# Altium schematic sheet cgd_gio.schdoc
size A3; Organization: Develer s.r.l.; Address1: via Mugellese 1/A; Address2: 50019 Campi Bisenzio; Address3: Firenze; Address4: ITALY; Revision: A; SheetNumber: 1; SheetTotal: 1
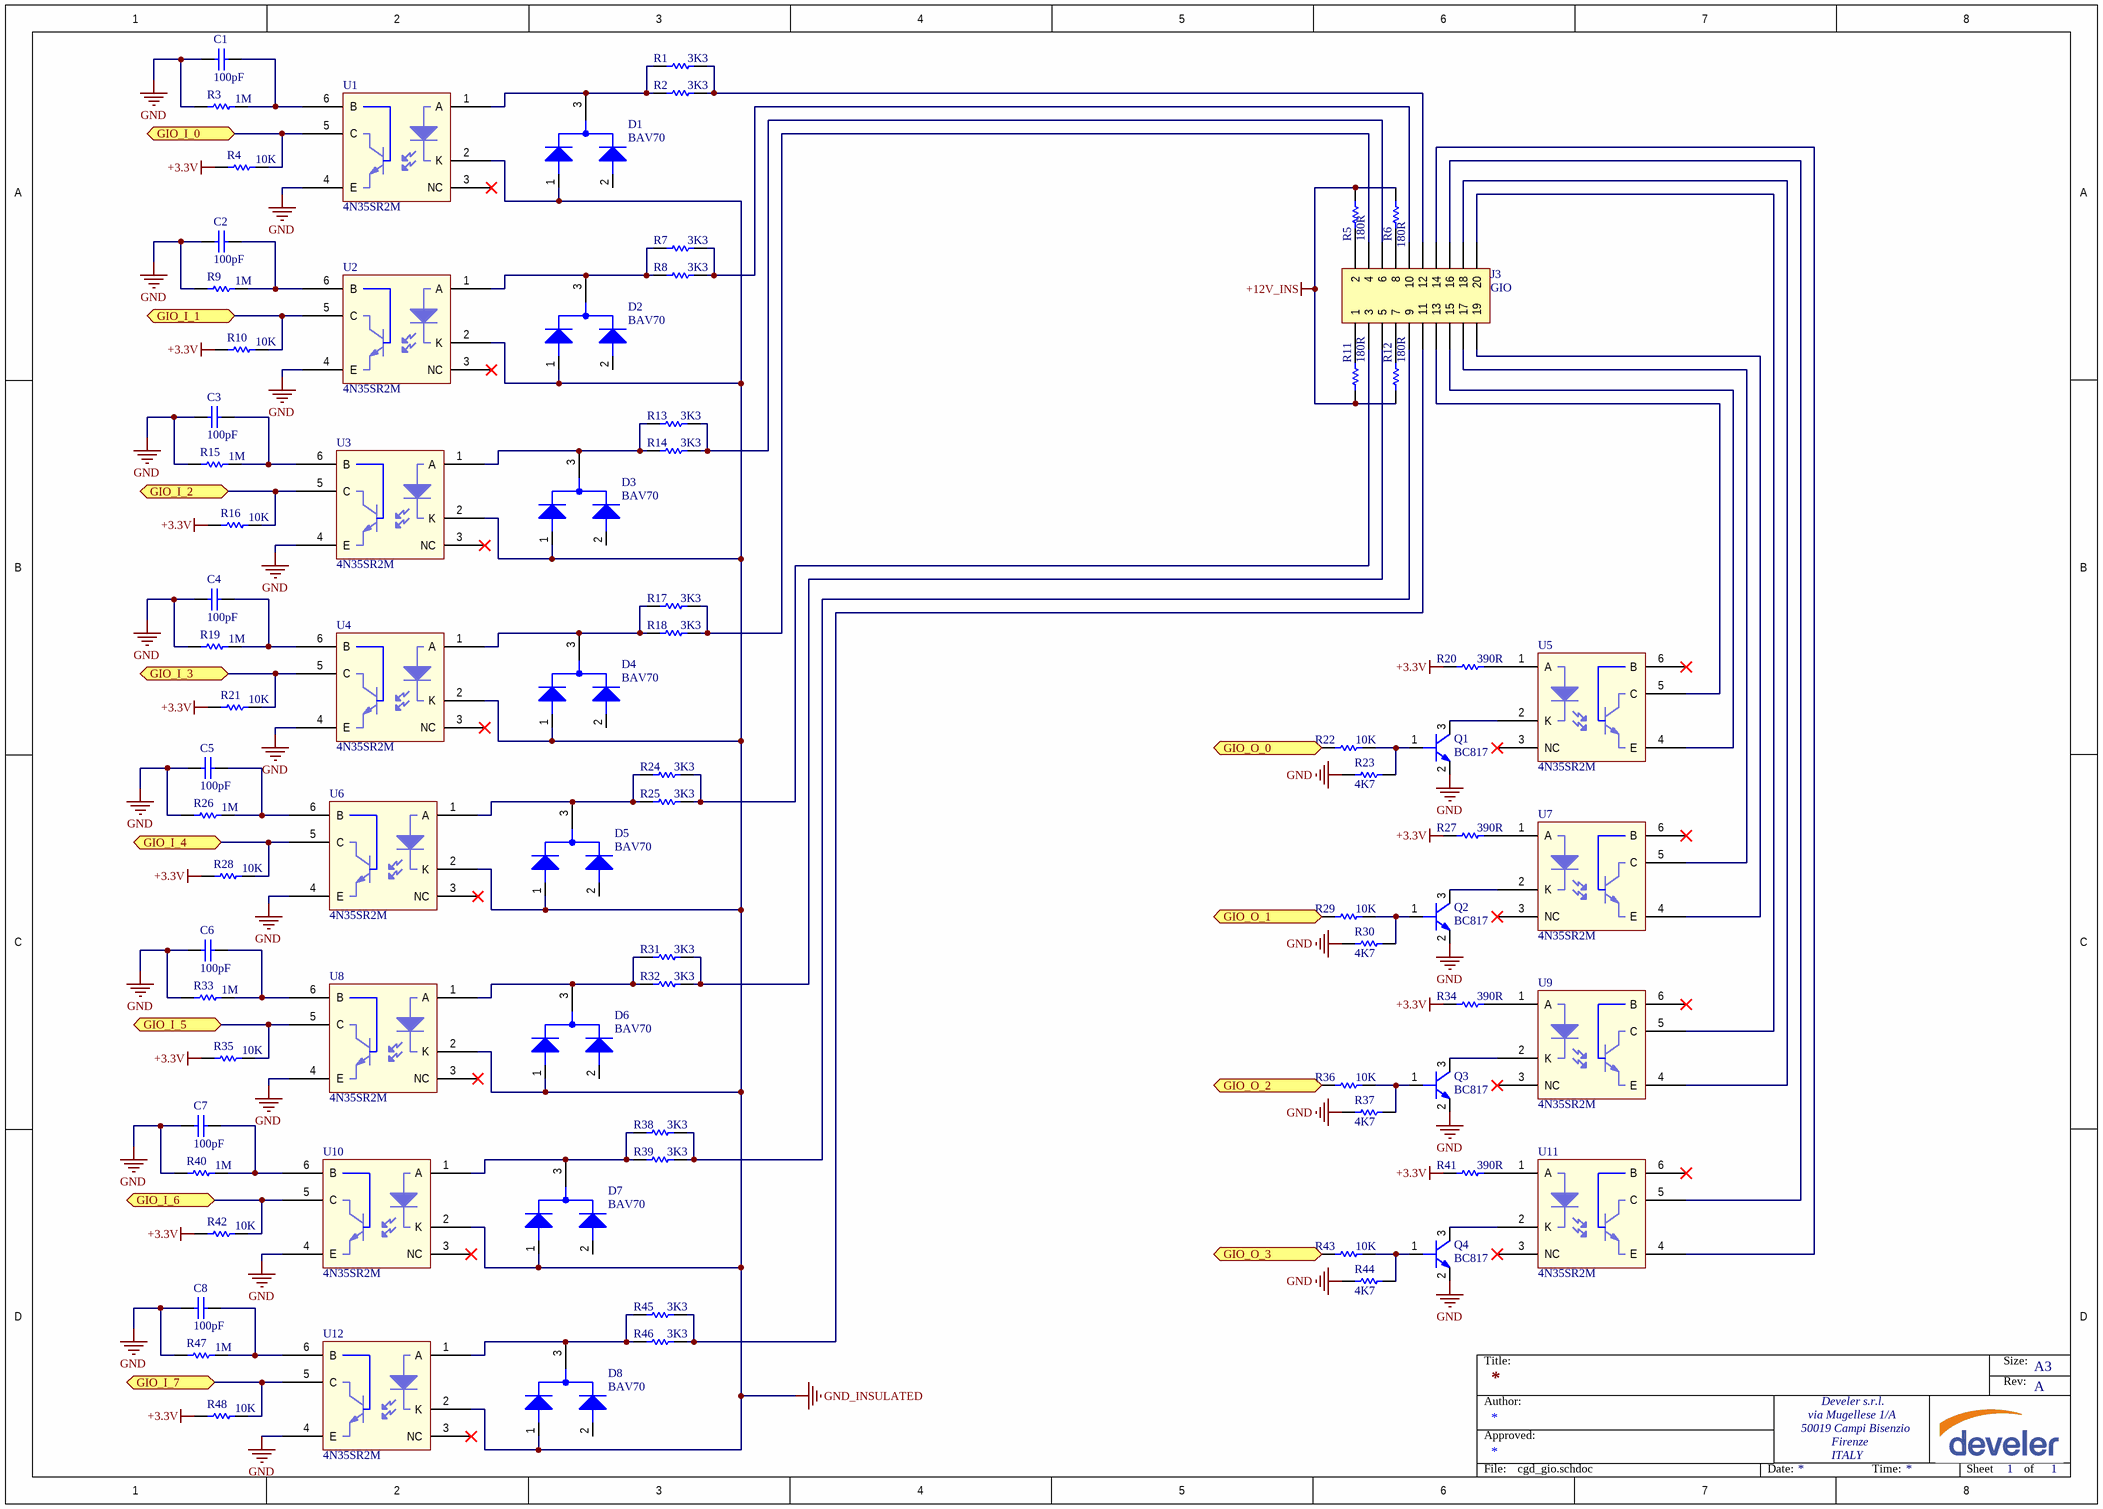
[diagram p0: cgd_gio.schdoc]

## Parts
C1  100pF  [0603_[1608]]
C2  100pF  [0603_[1608]]
C3  100pF  [0603_[1608]]
C4  100pF  [0603_[1608]]
C5  100pF  [0603_[1608]]
C6  100pF  [0603_[1608]]
C7  100pF  [0603_[1608]]
C8  100pF  [0603_[1608]]
D1  BAV70  [SOT-23]
D2  BAV70  [SOT-23]
D3  BAV70  [SOT-23]
D4  BAV70  [SOT-23]
D5  BAV70  [SOT-23]
D6  BAV70  [SOT-23]
D7  BAV70  [SOT-23]
D8  BAV70  [SOT-23]
J3  GIO  [TBLOCK_2X10_3.5MM_HOR_THD_FLANGED]
Q1  BC817  [SOT-23]
Q2  BC817  [SOT-23]
Q3  BC817  [SOT-23]
Q4  BC817  [SOT-23]
R1  3K3  [0603_[1608]]
R2  3K3  [0603_[1608]]
R3  1M  [0603_[1608]]
R4  10K  [0603_[1608]]
R5  180R  [0603_[1608]]
R6  180R  [0603_[1608]]
R7  3K3  [0603_[1608]]
R8  3K3  [0603_[1608]]
R9  1M  [0603_[1608]]
R10  10K  [0603_[1608]]
R11  180R  [0603_[1608]]
R12  180R  [0603_[1608]]
R13  3K3  [0603_[1608]]
R14  3K3  [0603_[1608]]
R15  1M  [0603_[1608]]
R16  10K  [0603_[1608]]
R17  3K3  [0603_[1608]]
R18  3K3  [0603_[1608]]
R19  1M  [0603_[1608]]
R20  390R  [0603_[1608]]
R21  10K  [0603_[1608]]
R22  10K  [0603_[1608]]
R23  4K7  [0603_[1608]]
R24  3K3  [0603_[1608]]
R25  3K3  [0603_[1608]]
R26  1M  [0603_[1608]]
R27  390R  [0603_[1608]]
R28  10K  [0603_[1608]]
R29  10K  [0603_[1608]]
R30  4K7  [0603_[1608]]
R31  3K3  [0603_[1608]]
R32  3K3  [0603_[1608]]
R33  1M  [0603_[1608]]
R34  390R  [0603_[1608]]
R35  10K  [0603_[1608]]
R36  10K  [0603_[1608]]
R37  4K7  [0603_[1608]]
R38  3K3  [0603_[1608]]
R39  3K3  [0603_[1608]]
R40  1M  [0603_[1608]]
R41  390R  [0603_[1608]]
R42  10K  [0603_[1608]]
R43  10K  [0603_[1608]]
R44  4K7  [0603_[1608]]
R45  3K3  [0603_[1608]]
R46  3K3  [0603_[1608]]
R47  1M  [0603_[1608]]
R48  10K  [0603_[1608]]
U1  4N35SR2M  [SOIC6_OPTO]
U2  4N35SR2M  [SOIC6_OPTO]
U3  4N35SR2M  [SOIC6_OPTO]
U4  4N35SR2M  [SOIC6_OPTO]
U5  4N35SR2M  [SOIC6_OPTO]
U6  4N35SR2M  [SOIC6_OPTO]
U7  4N35SR2M  [SOIC6_OPTO]
U8  4N35SR2M  [SOIC6_OPTO]
U9  4N35SR2M  [SOIC6_OPTO]
U10  4N35SR2M  [SOIC6_OPTO]
U11  4N35SR2M  [SOIC6_OPTO]
U12  4N35SR2M  [SOIC6_OPTO]

## Ports
GIO_I_0, GIO_I_1, GIO_I_2, GIO_I_3, GIO_I_4, GIO_I_5, GIO_I_6, GIO_I_7, GIO_O_0, GIO_O_1, GIO_O_2, GIO_O_3

## Nets
+3.3V: R4.2 R10.2 R16.2 R20.2 R21.2 R27.2 R28.2 R34.2 R35.2 R41.2 R42.2 R48.2
+12V_INS: R5.1 R6.1 R11.2 R12.2
GND: C1.2 C2.2 C3.2 C4.2 C5.2 C6.2 C7.2 C8.2 Q1.2(E) Q2.2(E) Q3.2(E) Q4.2(E) R3.2 R9.2 R15.2 R19.2 R23.1 R26.2 R30.1 R33.2 R37.1 R40.2 R44.1 R47.2 U1.4(E) U2.4(E) U3.4(E) U4.4(E) U6.4(E) U8.4(E) U10.4(E) U12.4(E)
GND_INSULATED: D1.1 D2.1 D3.1 D4.1 D5.1 D6.1 D7.1 D8.1 U1.2(K) U2.2(K) U3.2(K) U4.2(K) U6.2(K) U8.2(K) U10.2(K) U12.2(K)
GIO_I_0: R4.1 U1.5(C) ; port GIO_I_0
GIO_I_1: R10.1 U2.5(C) ; port GIO_I_1
GIO_I_2: R16.1 U3.5(C) ; port GIO_I_2
GIO_I_3: R21.1 U4.5(C) ; port GIO_I_3
GIO_I_4: R28.1 U6.5(C) ; port GIO_I_4
GIO_I_5: R35.1 U8.5(C) ; port GIO_I_5
GIO_I_6: R42.1 U10.5(C) ; port GIO_I_6
GIO_I_7: R48.1 U12.5(C) ; port GIO_I_7
GIO_O_0: R22.2 ; port GIO_O_0
GIO_O_1: R29.2 ; port GIO_O_1
GIO_O_2: R36.2 ; port GIO_O_2
GIO_O_3: R43.2 ; port GIO_O_3
NetC1_1: C1.1 R3.1 U1.6(B)
NetC2_1: C2.1 R9.1 U2.6(B)
NetC3_1: C3.1 R15.1 U3.6(B)
NetC4_1: C4.1 R19.1 U4.6(B)
NetC5_1: C5.1 R26.1 U6.6(B)
NetC6_1: C6.1 R33.1 U8.6(B)
NetC7_1: C7.1 R40.1 U10.6(B)
NetC8_1: C8.1 R47.1 U12.6(B)
NetD1_3: D1.3 R1.1 R2.1 U1.1(A)
NetD2_3: D2.3 R7.1 R8.1 U2.1(A)
NetD3_3: D3.3 R13.1 R14.1 U3.1(A)
NetD4_3: D4.3 R17.1 R18.1 U4.1(A)
NetD5_3: D5.3 R24.1 R25.1 U6.1(A)
NetD6_3: D6.3 R31.1 R32.1 U8.1(A)
NetD7_3: D7.3 R38.1 R39.1 U10.1(A)
NetD8_3: D8.3 R45.1 R46.1 U12.1(A)
NetJ3_1: J3.1 R11.1
NetJ3_2: J3.2 R5.2
NetJ3_3: J3.3 R24.2 R25.2
NetJ3_4: J3.4 R17.2 R18.2
NetJ3_5: J3.5 R31.2 R32.2
NetJ3_6: J3.6 R13.2 R14.2
NetJ3_7: J3.7 R12.1
NetJ3_8: J3.8 R6.2
NetJ3_9: J3.9 R38.2 R39.2
NetJ3_10: J3.10 R7.2 R8.2
NetJ3_11: J3.11 R45.2 R46.2
NetJ3_12: J3.12 R1.2 R2.2
NetJ3_13: J3.13 U5.5(C)
NetJ3_14: J3.14 U11.4(E)
NetJ3_15: J3.15 U5.4(E)
NetJ3_16: J3.16 U11.5(C)
NetJ3_17: J3.17 U7.5(C)
NetJ3_18: J3.18 U9.4(E)
NetJ3_19: J3.19 U7.4(E)
NetJ3_20: J3.20 U9.5(C)
NetQ1_1: Q1.1(B) R22.1 R23.2
NetQ1_3: Q1.3(C) U5.2(K)
NetQ2_1: Q2.1(B) R29.1 R30.2
NetQ2_3: Q2.3(C) U7.2(K)
NetQ3_1: Q3.1(B) R36.1 R37.2
NetQ3_3: Q3.3(C) U9.2(K)
NetQ4_1: Q4.1(B) R43.1 R44.2
NetQ4_3: Q4.3(C) U11.2(K)
NetR20_1: R20.1 U5.1(A)
NetR27_1: R27.1 U7.1(A)
NetR34_1: R34.1 U9.1(A)
NetR41_1: R41.1 U11.1(A)

Not connected (* = marked no-connect by the designer): D1 2; D2 2; D3 2; D4 2; D5 2; D6 2; D7 2; D8 2; U1 3(NC)*; U2 3(NC)*; U3 3(NC)*; U4 3(NC)*; U5 3(NC)* 6(B)*; U6 3(NC)*; U7 3(NC)* 6(B)*; U8 3(NC)*; U9 3(NC)* 6(B)*; U10 3(NC)*; U11 3(NC)* 6(B)*; U12 3(NC)*

## Notes on the sheet
- Title:
- Size:
- Rev:
- A3
- Author:
- Approved:
- File:
- Date:
- Time:
- Sheet
- of

## Library data of the parts
C1-C8 = Cap: Ceramic COG 50V; Value: 10nF; Published: 8-Jun-2000; Revision: July-2002: Re-released for DXP Platform.; Publisher: Altium Limited
D1-D8 = BAV70: Diode double
J3 = Header 10x2: Terminal Block 3.5mm Horizontal (Phoenix contact DMC 1,5/10-G1F-3,5-LR P20THR); LatestRevisionDate: 17-Jul-2002; LatestRevisionNote: Re-released for DXP Platform.; Publisher: Altium Limited
Q1-Q4 = BC817: BJT Transistor
R1-R48 = Res1: Resistor; Value: 1K; Published: 8-Jun-2000; Revision: July-2002: Re-released for DXP Platform.; Publisher: Altium Limited
U1-U12 = 4N2x: Optocoupler